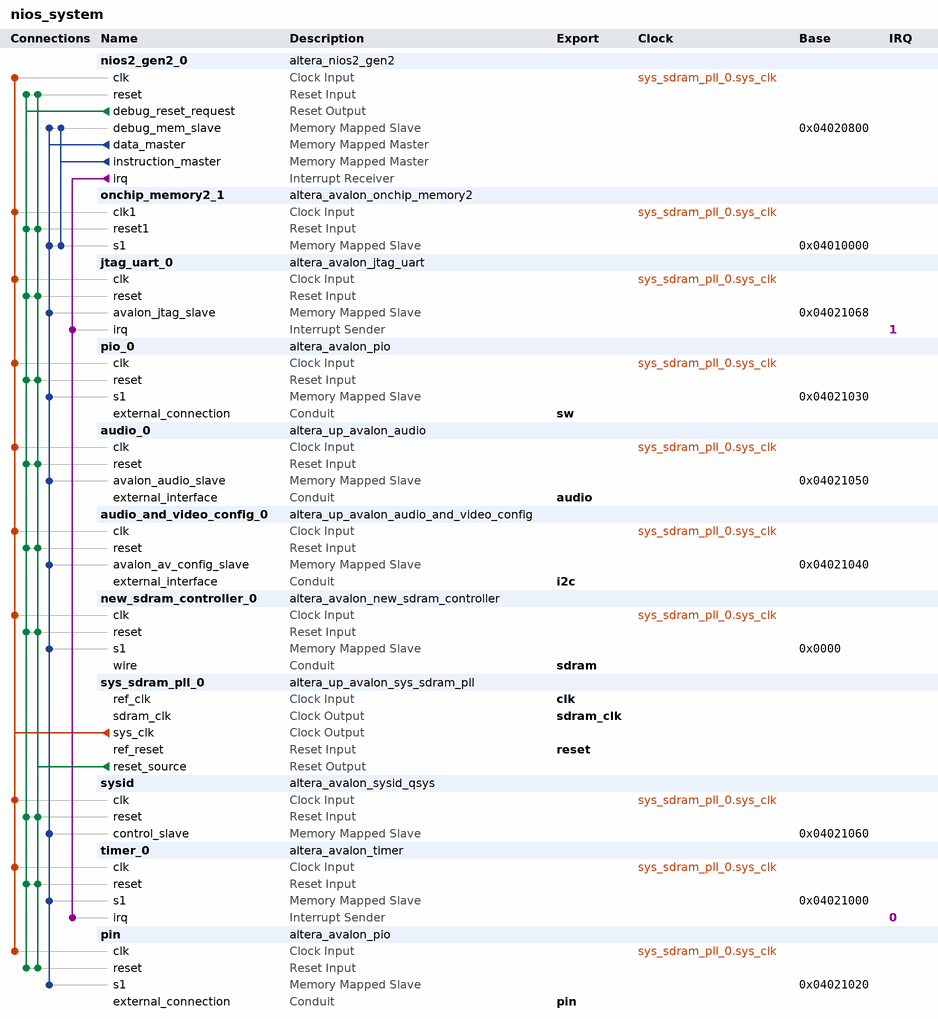
[diagram p0: system contents]
# Platform Designer (Qsys) system nios_system, Cyclone V 5CSEMA5F31C6
# Parameters at their usual value, and those the tool derives, are not listed.
package require -exact qsys 16.1
create_system nios_system
set_project_property DEVICE_FAMILY {Cyclone V}
set_project_property DEVICE 5CSEMA5F31C6

add_instance nios2_gen2_0 altera_nios2_gen2 16.1
set_instance_parameter_value nios2_gen2_0 dcache_size 2048
set_instance_parameter_value nios2_gen2_0 exceptionSlave onchip_memory2_1.s1
set_instance_parameter_value nios2_gen2_0 icache_size 4096
set_instance_parameter_value nios2_gen2_0 impl Tiny
set_instance_parameter_value nios2_gen2_0 resetSlave onchip_memory2_1.s1

add_instance onchip_memory2_1 altera_avalon_onchip_memory2 16.1
set_instance_parameter_value onchip_memory2_1 dataWidth 32
set_instance_parameter_value onchip_memory2_1 dualPort false
set_instance_parameter_value onchip_memory2_1 initMemContent true
set_instance_parameter_value onchip_memory2_1 initializationFileName onchip_mem.hex
set_instance_parameter_value onchip_memory2_1 memorySize 65536

add_instance jtag_uart_0 altera_avalon_jtag_uart 16.1
set_instance_parameter_value jtag_uart_0 simInteractiveOptions INTERACTIVE_ASCII_OUTPUT

add_instance pio_0 altera_avalon_pio 16.1
set_instance_parameter_value pio_0 captureEdge true
set_instance_parameter_value pio_0 direction Input
set_instance_parameter_value pio_0 irqType EDGE
set_instance_parameter_value pio_0 width 8

add_instance audio_0 altera_up_avalon_audio 16.1
set_instance_parameter_value audio_0 audio_in true
set_instance_parameter_value audio_0 avalon_bus_type {Memory Mapped}
set_instance_parameter_value audio_0 dw 16

add_instance audio_and_video_config_0 altera_up_avalon_audio_and_video_config 16.1
set_instance_parameter_value audio_and_video_config_0 audio_in {Microphone to ADC}
set_instance_parameter_value audio_and_video_config_0 bit_length 16
set_instance_parameter_value audio_and_video_config_0 board DE1-SoC
set_instance_parameter_value audio_and_video_config_0 line_in_bypass true
set_instance_parameter_value audio_and_video_config_0 sampling_rate {48 kHz}

add_instance new_sdram_controller_0 altera_avalon_new_sdram_controller 16.1
set_instance_parameter_value new_sdram_controller_0 TAC 5.4
set_instance_parameter_value new_sdram_controller_0 TRCD 15.0
set_instance_parameter_value new_sdram_controller_0 TRP 15.0
set_instance_parameter_value new_sdram_controller_0 casLatency 3
set_instance_parameter_value new_sdram_controller_0 columnWidth 10
set_instance_parameter_value new_sdram_controller_0 dataWidth 16
set_instance_parameter_value new_sdram_controller_0 generateSimulationModel false
set_instance_parameter_value new_sdram_controller_0 model single_Micron_MT48LC4M32B2_7_chip
set_instance_parameter_value new_sdram_controller_0 numberOfBanks 4
set_instance_parameter_value new_sdram_controller_0 numberOfChipSelects 1
set_instance_parameter_value new_sdram_controller_0 powerUpDelay 100.0
set_instance_parameter_value new_sdram_controller_0 refreshPeriod 7.8125
set_instance_parameter_value new_sdram_controller_0 rowWidth 13

add_instance sys_sdram_pll_0 altera_up_avalon_sys_sdram_pll 16.1
set_instance_parameter_value sys_sdram_pll_0 CV_boards DE1-SoC
set_instance_parameter_value sys_sdram_pll_0 gui_outclk 50.0
set_instance_parameter_value sys_sdram_pll_0 gui_refclk 50.0

add_instance sysid altera_avalon_sysid_qsys 16.1
set_instance_parameter_value sysid id 1

add_instance timer_0 altera_avalon_timer 16.1
set_instance_parameter_value timer_0 alwaysRun true
set_instance_parameter_value timer_0 fixedPeriod true
set_instance_parameter_value timer_0 period 20.48
set_instance_parameter_value timer_0 periodUnits USEC
set_instance_parameter_value timer_0 snapshot false

add_instance pin altera_avalon_pio 16.1
set_instance_parameter_value pin direction Output
set_instance_parameter_value pin width 1

# connections
add_connection sys_sdram_pll_0.sys_clk audio_0.clk clock
add_connection sys_sdram_pll_0.sys_clk audio_and_video_config_0.clk clock
add_connection sys_sdram_pll_0.sys_clk jtag_uart_0.clk clock
add_connection sys_sdram_pll_0.sys_clk new_sdram_controller_0.clk clock
add_connection sys_sdram_pll_0.sys_clk nios2_gen2_0.clk clock
add_connection sys_sdram_pll_0.sys_clk onchip_memory2_1.clk1 clock
add_connection sys_sdram_pll_0.sys_clk pin.clk clock
add_connection sys_sdram_pll_0.sys_clk pio_0.clk clock
add_connection sys_sdram_pll_0.sys_clk sysid.clk clock
add_connection sys_sdram_pll_0.sys_clk timer_0.clk clock
add_connection nios2_gen2_0.debug_reset_request audio_0.reset reset
add_connection nios2_gen2_0.debug_reset_request audio_and_video_config_0.reset reset
add_connection nios2_gen2_0.debug_reset_request jtag_uart_0.reset reset
add_connection nios2_gen2_0.debug_reset_request new_sdram_controller_0.reset reset
add_connection nios2_gen2_0.debug_reset_request nios2_gen2_0.reset reset
add_connection nios2_gen2_0.debug_reset_request onchip_memory2_1.reset1 reset
add_connection nios2_gen2_0.debug_reset_request pin.reset reset
add_connection nios2_gen2_0.debug_reset_request pio_0.reset reset
add_connection nios2_gen2_0.debug_reset_request sysid.reset reset
add_connection nios2_gen2_0.debug_reset_request timer_0.reset reset
add_connection sys_sdram_pll_0.reset_source audio_0.reset reset
add_connection sys_sdram_pll_0.reset_source audio_and_video_config_0.reset reset
add_connection sys_sdram_pll_0.reset_source jtag_uart_0.reset reset
add_connection sys_sdram_pll_0.reset_source new_sdram_controller_0.reset reset
add_connection sys_sdram_pll_0.reset_source nios2_gen2_0.reset reset
add_connection sys_sdram_pll_0.reset_source onchip_memory2_1.reset1 reset
add_connection sys_sdram_pll_0.reset_source pin.reset reset
add_connection sys_sdram_pll_0.reset_source pio_0.reset reset
add_connection sys_sdram_pll_0.reset_source sysid.reset reset
add_connection sys_sdram_pll_0.reset_source timer_0.reset reset
add_connection nios2_gen2_0.data_master audio_0.avalon_audio_slave avalon
set_connection_parameter_value nios2_gen2_0.data_master/audio_0.avalon_audio_slave baseAddress 0x04021050
add_connection nios2_gen2_0.data_master audio_and_video_config_0.avalon_av_config_slave avalon
set_connection_parameter_value nios2_gen2_0.data_master/audio_and_video_config_0.avalon_av_config_slave baseAddress 0x04021040
add_connection nios2_gen2_0.data_master jtag_uart_0.avalon_jtag_slave avalon
set_connection_parameter_value nios2_gen2_0.data_master/jtag_uart_0.avalon_jtag_slave baseAddress 0x04021068
add_connection nios2_gen2_0.data_master new_sdram_controller_0.s1 avalon
set_connection_parameter_value nios2_gen2_0.data_master/new_sdram_controller_0.s1 baseAddress 0x0000
add_connection nios2_gen2_0.data_master nios2_gen2_0.debug_mem_slave avalon
set_connection_parameter_value nios2_gen2_0.data_master/nios2_gen2_0.debug_mem_slave baseAddress 0x04020800
add_connection nios2_gen2_0.data_master onchip_memory2_1.s1 avalon
set_connection_parameter_value nios2_gen2_0.data_master/onchip_memory2_1.s1 baseAddress 0x04010000
add_connection nios2_gen2_0.data_master pin.s1 avalon
set_connection_parameter_value nios2_gen2_0.data_master/pin.s1 baseAddress 0x04021020
add_connection nios2_gen2_0.data_master pio_0.s1 avalon
set_connection_parameter_value nios2_gen2_0.data_master/pio_0.s1 baseAddress 0x04021030
add_connection nios2_gen2_0.data_master sysid.control_slave avalon
set_connection_parameter_value nios2_gen2_0.data_master/sysid.control_slave baseAddress 0x04021060
add_connection nios2_gen2_0.data_master timer_0.s1 avalon
set_connection_parameter_value nios2_gen2_0.data_master/timer_0.s1 baseAddress 0x04021000
add_connection nios2_gen2_0.instruction_master nios2_gen2_0.debug_mem_slave avalon
set_connection_parameter_value nios2_gen2_0.instruction_master/nios2_gen2_0.debug_mem_slave baseAddress 0x04020800
add_connection nios2_gen2_0.instruction_master onchip_memory2_1.s1 avalon
set_connection_parameter_value nios2_gen2_0.instruction_master/onchip_memory2_1.s1 baseAddress 0x04010000
add_connection nios2_gen2_0.irq jtag_uart_0.irq interrupt
set_connection_parameter_value nios2_gen2_0.irq/jtag_uart_0.irq irqNumber 1
add_connection nios2_gen2_0.irq timer_0.irq interrupt
set_connection_parameter_value nios2_gen2_0.irq/timer_0.irq irqNumber 0

# exported interfaces
add_interface audio conduit end
set_interface_property audio EXPORT_OF audio_0.external_interface
add_interface clk clock sink
set_interface_property clk EXPORT_OF sys_sdram_pll_0.ref_clk
add_interface i2c conduit end
set_interface_property i2c EXPORT_OF audio_and_video_config_0.external_interface
add_interface pin conduit end
set_interface_property pin EXPORT_OF pin.external_connection
add_interface reset reset sink
set_interface_property reset EXPORT_OF sys_sdram_pll_0.ref_reset
add_interface sdram conduit end
set_interface_property sdram EXPORT_OF new_sdram_controller_0.wire
add_interface sdram_clk clock source
set_interface_property sdram_clk EXPORT_OF sys_sdram_pll_0.sdram_clk
add_interface sw conduit end
set_interface_property sw EXPORT_OF pio_0.external_connection

set_interconnect_requirement {$system} qsys_mm.clockCrossingAdapter HANDSHAKE
set_interconnect_requirement {$system} qsys_mm.maxAdditionalLatency 0

save_system nios_system.qsys
